# Altium schematic sheet INOUT.SchDoc
size A; SheetNumber: 2; SheetTotal: 2
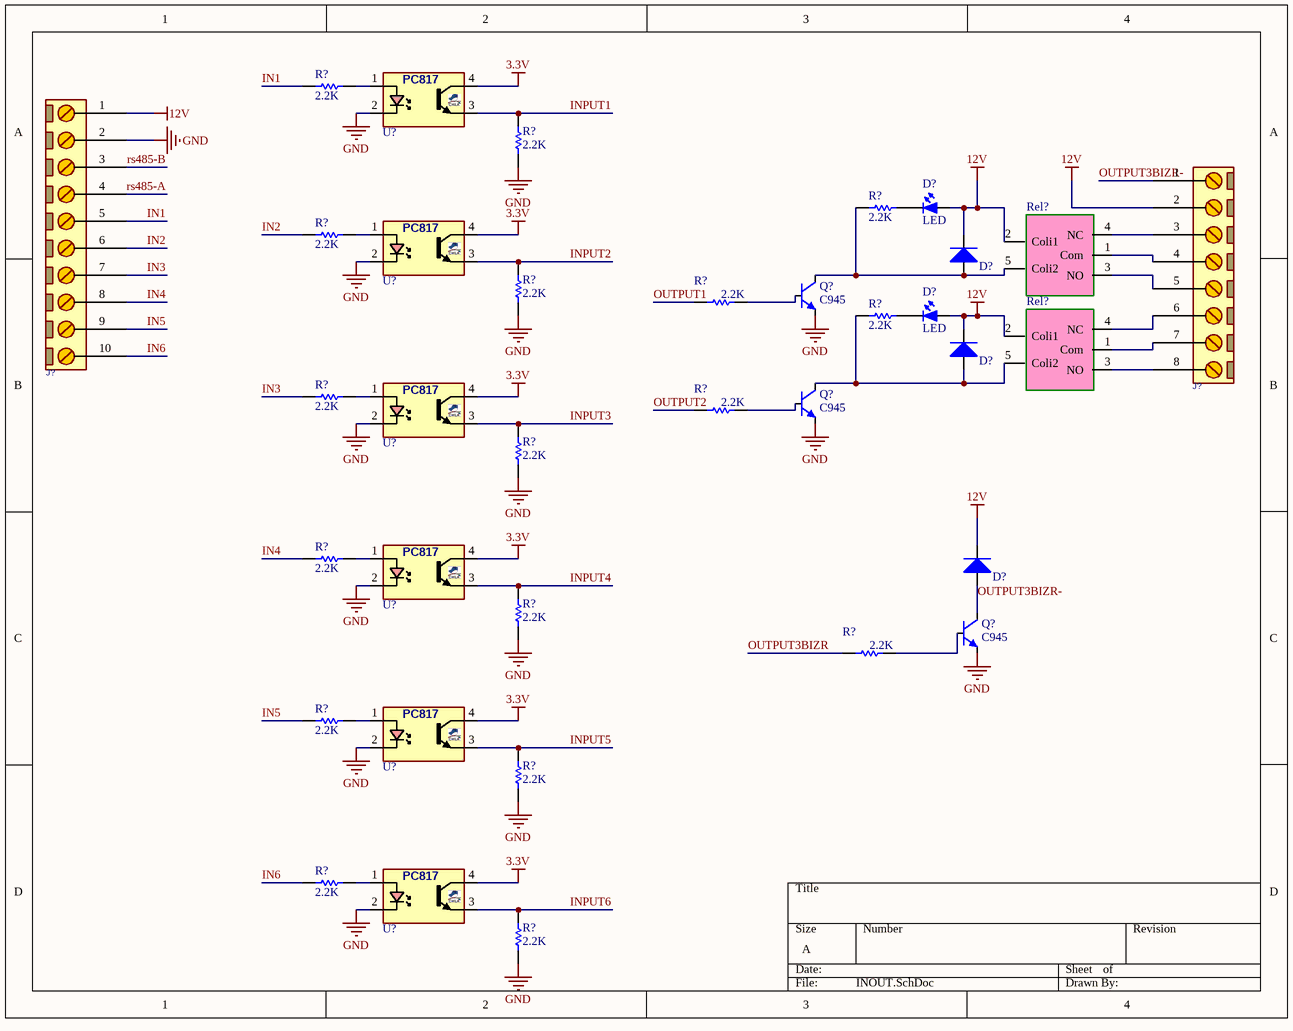
[diagram p0: INOUT.SchDoc]

## Parts
(Parts that share a designator on the sheet are numbered #1, #2 ... from top to bottom, then left to right.)
D?#1  LED  [0603 - LED]
D?#2  1n4007  [DIOM4629X24N]  (value not drawn)
D?#3  LED  [0603 - LED]
D?#4  1n4007  [DIOM4629X24N]  (value not drawn)
D?#5  1n4007  [DIOM4629X24N]  (value not drawn)
J?#1  CONN_TB10  [MSTB_10]  (value not drawn)
J?#2  CONN_TB8  [MSTB_8]  (value not drawn)
Q?#1  C945  [SOT23_M]
Q?#2  C945  [SOT23_M]
Q?#3  C945  [SOT23_M]
R?#1  2.2K  [RES0805]
R?#2  2.2K  [RES0805]
R?#3  2.2K  [RES0805]
R?#4  2.2K  [RES0805]
R?#5  2.2K  [RES0805]
R?#6  2.2K  [RES0805]
R?#7  2.2K  [RES0805]
R?#8  2.2K  [RES0805]
R?#9  2.2K  [RES0805]
R?#10  2.2K  [RES0805]
R?#11  2.2K  [RES0805]
R?#12  2.2K  [RES0805]
R?#13  2.2K  [RES0805]
R?#14  2.2K  [RES0805]
R?#15  2.2K  [RES0805]
R?#16  2.2K  [RES0805]
R?#17  2.2K  [RES0805]
Rel?#1  RelayGH-1C-12L  [GH-1C-12L]  (value not drawn)
Rel?#2  RelayGH-1C-12L  [GH-1C-12L]  (value not drawn)
U?#1  PC817  [DIP_4]  (value not drawn)
U?#2  PC817  [DIP_4]  (value not drawn)
U?#3  PC817  [DIP_4]  (value not drawn)
U?#4  PC817  [DIP_4]  (value not drawn)
U?#5  PC817  [DIP_4]  (value not drawn)
U?#6  PC817  [DIP_4]  (value not drawn)

## Nets
3.3V: U?#1.4(C) U?#2.4(C) U?#3.4(C) U?#4.4(C) U?#5.4(C) U?#6.4(C)
12V: D?#1.1(A) D?#2.2(K) D?#3.1(A) D?#4.2(K) D?#5.2(K) J?#1.1 J?#2.2 Rel?#1.2(Coli1) Rel?#2.2(Coli1)
GND: J?#1.2 Q?#1.2(E) Q?#2.2(E) Q?#3.2(E) R?#2.2 R?#5.2 R?#10.2 R?#12.2 R?#15.2 R?#17.2 U?#1.2(K) U?#2.2(K) U?#3.2(K) U?#4.2(K) U?#5.2(K) U?#6.2(K)
IN1: J?#1.5 R?#1.1
IN2: J?#1.6 R?#4.1
IN3: J?#1.7 R?#8.1
IN4: J?#1.8 R?#11.1
IN5: J?#1.9 R?#14.1
IN6: J?#1.10 R?#16.1
INPUT1: R?#2.1 U?#1.3(E)
INPUT2: R?#5.1 U?#2.3(E)
INPUT3: R?#10.1 U?#3.3(E)
INPUT4: R?#12.1 U?#4.3(E)
INPUT5: R?#15.1 U?#5.3(E)
INPUT6: R?#17.1 U?#6.3(E)
OUTPUT1: R?#6.1
OUTPUT2: R?#9.1
OUTPUT3BIZR: R?#13.1
OUTPUT3BIZR-: D?#5.1(A) J?#2.1 Q?#3.3(C)
rs485-A: J?#1.4
rs485-B: J?#1.3
NetD?#1_2: D?#1.2(K) R?#3.2
NetD?#2_1: D?#2.1(A) Q?#1.3(C) R?#3.1 Rel?#1.5(Coli2)
NetD?#3_2: D?#3.2(K) R?#7.2
NetD?#4_1: D?#4.1(A) Q?#2.3(C) R?#7.1 Rel?#2.5(Coli2)
NetJ?#2_3: J?#2.3 Rel?#1.4(NC)
NetJ?#2_4: J?#2.4 Rel?#1.1(Com)
NetJ?#2_5: J?#2.5 Rel?#1.3(NO)
NetJ?#2_6: J?#2.6 Rel?#2.4(NC)
NetJ?#2_7: J?#2.7 Rel?#2.1(Com)
NetJ?#2_8: J?#2.8 Rel?#2.3(NO)
NetQ?#1_1: Q?#1.1(B) R?#6.2
NetQ?#2_1: Q?#2.1(B) R?#9.2
NetQ?#3_1: Q?#3.1(B) R?#13.2
NetR?#1_2: R?#1.2 U?#1.1(A)
NetR?#4_2: R?#4.2 U?#2.1(A)
NetR?#8_2: R?#8.2 U?#3.1(A)
NetR?#11_2: R?#11.2 U?#4.1(A)
NetR?#14_2: R?#14.2 U?#5.1(A)
NetR?#16_2: R?#16.2 U?#6.1(A)

## Library data of the parts
D?#2 D?#4 D?#5 = 1n4007 SMD M7: Standard Rectifiers; Part. No: M7; Manufacturer: DC COMPONENTS; Designer: Abbas Basereh; Link: http://www.tme.eu/en/details/m7/smd-universal-diodes/dc-components/; Link: https://www.aliexpress.com/item/Smd-tube-1n4007-m7-SMA/1213719741.html?spm=2114.01010208.3.1.ZyZ7bC&ws_ab_test=searchweb0_0,searchweb201602_4_10065_10068_10084_10083_10080_10082_10081_10060_10061_10062_10056_10055_10054_10059_10099_10078_10079_427_10073_10103_10102_10096_10052_10050_10051,searchweb201603_4&btsid=db2be5ca-e560-400a-b91c-484ab5ee228b; Data: 16-12-2016
J?#1 = CONN_MSTB_10: CONN, PHOENIX MSTB, 5-G, 5.08mm pitch; VALUE: CONN_TB10
J?#2 = CONN_MSTB_8: CONN, PHOENIX MSTB, 5-G, 5.08mm pitch; VALUE: CONN_TB8
Q?#1-Q?#3 = C945: NPN Silicon Epitaxial Planar Transistor; Published: 2017-2-8; LatestRevisionDate: 2017; LatestRevisionNote: IPC-7351 Footprint Added.; DatasheetVersion: 2017; PackageVersion: 2017-2-8; PackageReference: SOT23; Publisher: Abbas Basereh; PackageDescription: 3-Pin SOT-23 Package 0.95 mm Pitch, 2.3 mm Lead Span; ComponentLink1Description: Manufacturer Link; ComponentLink1URL: http://www.taitroncomponents.com/; ComponentLink2Description: Datasheet; ComponentLink2URL: http://www.taitroncomponents.com/
R?#1-R?#17 = RES SMD PACKAGE: TOTAL SMD RESISTOR PACK; Designer: Abbas Basereh; Desc.: RES SMD PAKAGES; Data: 2017-3-10; VALUE: 2.2K
Rel?#1 Rel?#2 = RelayGH-1C-12L: HJR-3FF-12VDC-S-Z
U?#1-U?#6 = OPTC_TR4P_PC817: OPTOCOUPLER, TRANSISTOR, 4PIN; PARAM: IF=20mA; PARAM2: VCE = 35V; MANF: SHARP; MANF_P#: PC817; PRICE: -; VALUE: PC817
D?#1 D?#3 = LED: Published: 8-Jun-2000; LatestRevisionDate: 08-Jul-2005; LatestRevisionNote: Mech Layer 1 removed.; PackageReference: LED-0; Publisher: Altium Limited